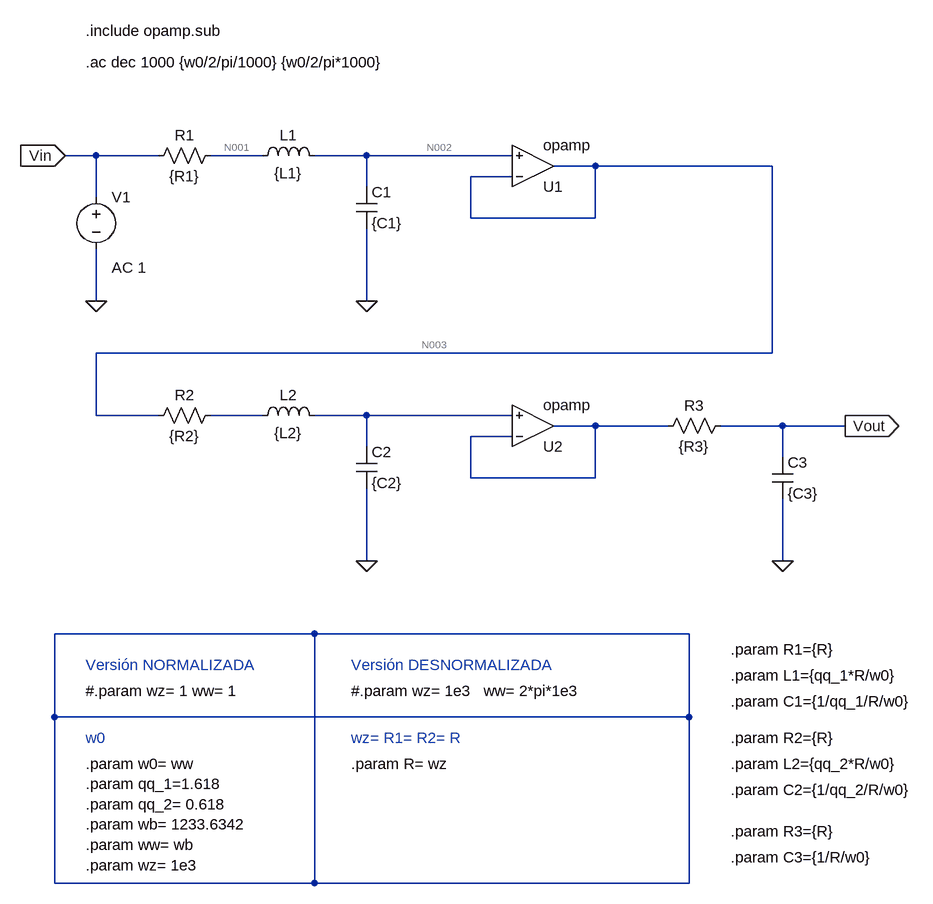
[diagram p0: schematic 02.asc]
02.asc, the LTspice schematic file:
Version 4
SHEET 1 1836 888
WIRE -560 -400 -608 -400
WIRE -464 -400 -560 -400
WIRE -304 -400 -384 -400
WIRE -144 -400 -224 -400
WIRE 80 -400 -144 -400
WIRE 208 -384 144 -384
WIRE 480 -384 208 -384
WIRE 80 -368 16 -368
WIRE -144 -352 -144 -400
WIRE -560 -336 -560 -400
WIRE 16 -304 16 -368
WIRE 208 -304 208 -384
WIRE 208 -304 16 -304
WIRE -560 -176 -560 -256
WIRE -144 -176 -144 -288
WIRE 480 -96 480 -384
WIRE 480 -96 -560 -96
WIRE -560 0 -560 -96
WIRE -464 0 -560 0
WIRE -304 0 -384 0
WIRE -144 0 -224 0
WIRE 80 0 -144 0
WIRE 208 16 144 16
WIRE 320 16 208 16
WIRE 496 16 400 16
WIRE 592 16 496 16
WIRE 80 32 16 32
WIRE -144 48 -144 0
WIRE 496 64 496 16
WIRE 16 96 16 32
WIRE 208 96 208 16
WIRE 208 96 16 96
WIRE -144 224 -144 112
WIRE 496 224 496 128
WIRE -224 336 -624 336
WIRE 352 336 -224 336
WIRE -624 464 -624 336
WIRE 352 464 352 336
WIRE 352 464 -624 464
WIRE -624 720 -624 464
WIRE -224 720 -224 336
WIRE -224 720 -624 720
WIRE 352 720 352 464
WIRE 352 720 -224 720
FLAG -144 -176 0
FLAG -560 -176 0
FLAG -608 -400 Vin
IOPIN -608 -400 In
FLAG 496 224 0
FLAG 592 16 Vout
IOPIN 592 16 Out
FLAG -144 224 0
SYMBOL Opamps\\opamp 112 -320 M180
SYMATTR InstName U1
SYMBOL res -368 -416 R90
WINDOW 0 0 56 VBottom 2
WINDOW 3 32 56 VTop 2
SYMATTR InstName R1
SYMATTR Value {R1}
SYMBOL cap -160 -352 R0
SYMATTR InstName C1
SYMATTR Value {C1}
SYMBOL res 416 0 R90
WINDOW 0 0 56 VBottom 2
WINDOW 3 32 56 VTop 2
SYMATTR InstName R3
SYMATTR Value {R3}
SYMBOL cap 480 64 R0
SYMATTR InstName C3
SYMATTR Value {C3}
SYMBOL voltage -560 -352 R0
WINDOW 123 24 124 Left 2
WINDOW 39 0 0 Left 0
SYMATTR Value2 AC 1
SYMATTR InstName V1
SYMATTR Value ""
SYMBOL ind -320 -384 R270
WINDOW 0 32 56 VTop 2
WINDOW 3 5 56 VBottom 2
SYMATTR InstName L1
SYMATTR Value {L1}
SYMBOL Opamps\\opamp 112 80 M180
SYMATTR InstName U2
SYMBOL res -368 -16 R90
WINDOW 0 0 56 VBottom 2
WINDOW 3 32 56 VTop 2
SYMATTR InstName R2
SYMATTR Value {R2}
SYMBOL cap -160 48 R0
SYMATTR InstName C2
SYMATTR Value {C2}
SYMBOL ind -320 16 R270
WINDOW 0 32 56 VTop 2
WINDOW 3 5 56 VBottom 2
SYMATTR InstName L2
SYMATTR Value {L2}
TEXT -576 -592 Left 2 !.include opamp.sub
TEXT -576 -544 Left 2 !.ac dec 1000 {w0/2/pi/1000} {w0/2/pi*1000}
TEXT -576 384 Left 2 ;Versión NORMALIZADA
TEXT -576 424 Left 2 !#.param wz= 1 ww= 1
TEXT -168 384 Left 2 ;Versión DESNORMALIZADA
TEXT -168 424 Left 2 !#.param wz= 1e3   ww= 2*pi*1e3
TEXT 416 440 Left 2 !.param C1={1/qq_1/R/w0}
TEXT -576 496 Left 2 ;w0
TEXT -576 536 Left 2 !.param w0= ww\n.param qq_1=1.618\n.param qq_2= 0.618\n.param wb= 1233.6342\n.param ww= wb\n.param wz= 1e3
TEXT -168 496 Left 2 ;wz= R1= R2= R
TEXT -168 536 Left 2 !.param R= wz
TEXT 416 680 Left 2 !.param C3={1/R/w0}
TEXT 416 360 Left 2 !.param R1={R}
TEXT 416 640 Left 2 !.param R3={R}
TEXT 416 400 Left 2 !.param L1={qq_1*R/w0}
TEXT 416 576 Left 2 !.param C2={1/qq_2/R/w0}
TEXT 416 496 Left 2 !.param R2={R}
TEXT 416 536 Left 2 !.param L2={qq_2*R/w0}

The netlist it stands for:
* 02.asc
XU1 N003 N002 N003 opamp Aol=100K GBW=10Meg  ; pins invin noninvin out
R1 N001 Vin {R1}
C1 N002 0 {C1}
R3 Vout N006 {R3}
C3 Vout 0 {C3}
V1 Vin 0 AC 1
L1 N001 N002 {L1}
XU2 N006 N005 N006 opamp Aol=100K GBW=10Meg  ; pins invin noninvin out
R2 N004 N003 {R2}
C2 N005 0 {C2}
L2 N004 N005 {L2}
.include opamp.sub
.ac dec 1000 {w0/2/pi/1000} {w0/2/pi*1000}
* Versión NORMALIZADA
#.param wz= 1 ww= 1
* Versión DESNORMALIZADA
#.param wz= 1e3   ww= 2*pi*1e3
.param C1={1/qq_1/R/w0}
* w0
.param w0= ww
.param qq_1=1.618
.param qq_2= 0.618
.param wb= 1233.6342
.param ww= wb
.param wz= 1e3
* wz= R1= R2= R
.param R= wz
.param C3={1/R/w0}
.param R1={R}
.param R3={R}
.param L1={qq_1*R/w0}
.param C2={1/qq_2/R/w0}
.param R2={R}
.param L2={qq_2*R/w0}
.backanno
.end

* Results of the author's LTspice run, read from the files saved beside the schematic
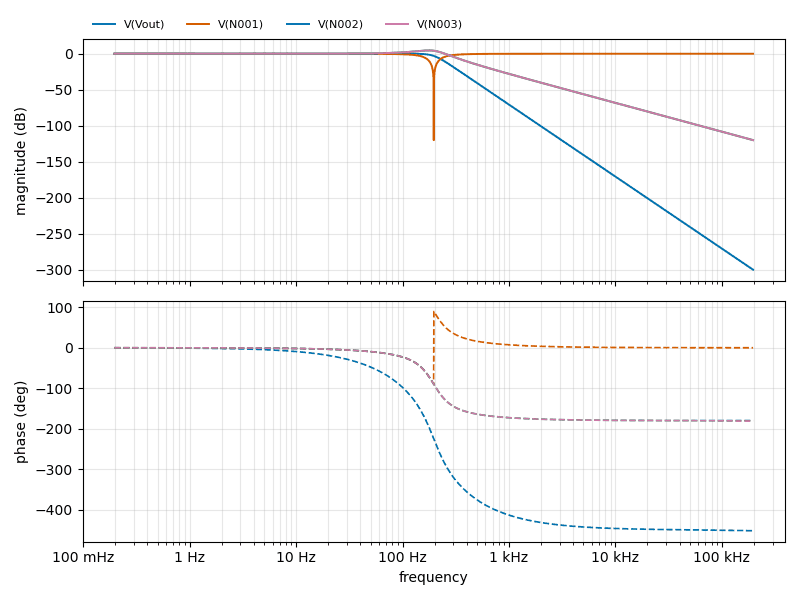
[diagram p1: AC Analysis of 02.asc, plotted from the saved traces]
* AC Analysis, 1 run:
*   V(Vout): -0.00 dB at 196.3 mHz, -300.00 dB at 196.3 kHz, peak -0.00 dB at 196.3 mHz, 3 dB below the peak at 196.3 Hz
*   V(N001): -0.00 dB at 196.3 mHz, -0.00 dB at 196.3 kHz, peak -0.00 dB at 196.3 mHz, 3 dB below the peak at 144.8 Hz
*   V(N002): 0.00 dB at 196.3 mHz, -120.00 dB at 196.3 kHz, peak 4.62 dB at 176.6 Hz, 3 dB below the peak at 92.34 Hz and 232 Hz
*   V(N003): -0.00 dB at 196.3 mHz, -120.00 dB at 196.3 kHz, peak 4.62 dB at 176.6 Hz, 3 dB below the peak at 92.34 Hz and 232 Hz